# Altium project QMKMouse.PrjPCB
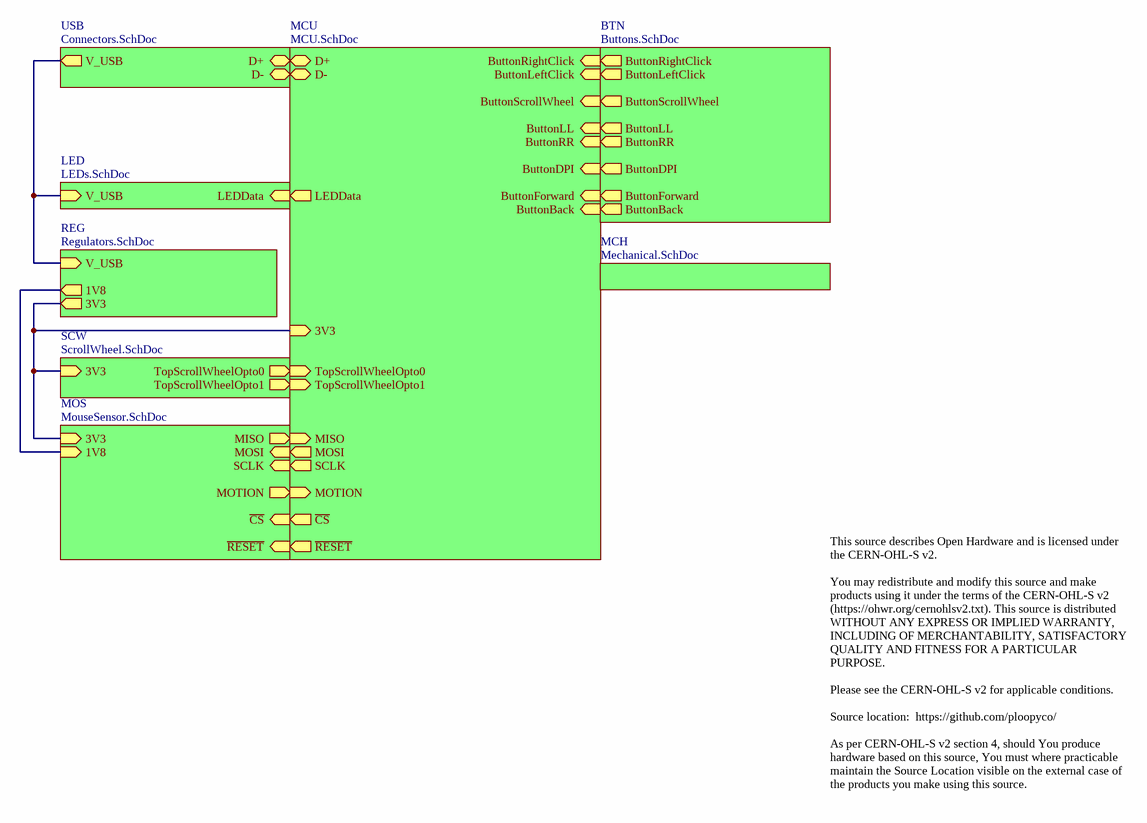
[diagram p0: QMKMouse.SchDoc]
9 sheets, 110 parts. Net scope: hierarchical (ports join the sheet entries above them; power ports are global).
Board files: QMKMouse.PcbDoc, QMKMouseSolderStencil.PcbDoc, QMKMousePanel.PcbDoc
Sheets:
  QMKMouse.SchDoc
    USB = Connectors.SchDoc
    LED = LEDs.SchDoc
    REG = Regulators.SchDoc
    SCW = ScrollWheel.SchDoc
    MOS = MouseSensor.SchDoc
    MCU = MCU.SchDoc
    BTN = Buttons.SchDoc
    MCH = Mechanical.SchDoc

## Sheet QMKMouse.SchDoc
size Letter; CompanyName: Ploopy Corporation; Organization: Ploopy Corporation; Address1: 137-1140 Burnhamthorpe Road W; Address2: Mississauga; Address3: Ontario; Address4: Canada L5C 0A3; DocumentNumber: 1; Revision: R1.003; SheetNumber: 1; SheetTotal: 9

### Sub-sheets
BTN = Buttons.SchDoc: ButtonRightClick (out), ButtonLeftClick (out), ButtonScrollWheel (out), ButtonLL (out), ButtonRR (out), ButtonDPI (out), ButtonForward (out), ButtonBack (out)
LED = LEDs.SchDoc: V_USB (in), LEDData (in)
MCH = Mechanical.SchDoc: no entries
MCU = MCU.SchDoc: D+ (bidir), D- (bidir), ButtonRightClick (in), ButtonLeftClick (in), ButtonScrollWheel (in), ButtonLL (in), ButtonRR (in), ButtonDPI (in), ButtonForward (in), ButtonBack (in), LEDData (out), 3V3 (in), TopScrollWheelOpto1 (in), TopScrollWheelOpto0 (in), MOSI (out), SCLK (out), MISO (in), ~{CS} (out), ~{RESET} (out), MOTION (in)
MOS = MouseSensor.SchDoc: 1V8 (in), 3V3 (in), ~{CS} (in), MISO (out), MOSI (in), SCLK (in), ~{RESET} (in), MOTION (out)
REG = Regulators.SchDoc: 3V3 (out), V_USB (in), 1V8 (out)
SCW = ScrollWheel.SchDoc: TopScrollWheelOpto1 (out), TopScrollWheelOpto0 (out), 3V3 (in)
USB = Connectors.SchDoc: D+ (bidir), V_USB (out), D- (bidir)

### Nets
1V8: sheet REG/1V8, sheet MOS/1V8
3V3: sheet REG/3V3, sheet SCW/3V3, sheet MOS/3V3, sheet MCU/3V3
LEDData: sheet LED/LEDData, sheet MCU/LEDData
V_USB: sheet USB/V_USB, sheet LED/V_USB, sheet REG/V_USB
NetQt1_E: sheet SCW/TopScrollWheelOpto0, sheet MCU/TopScrollWheelOpto0
NetQt2_E: sheet SCW/TopScrollWheelOpto1, sheet MCU/TopScrollWheelOpto1
NetR5_1: sheet MOS/MISO, sheet MCU/MISO
NetR6_2: sheet USB/D-, sheet MCU/D-
NetR7_2: sheet USB/D+, sheet MCU/D+
NetSW1_A: sheet MCU/ButtonLeftClick, sheet BTN/ButtonLeftClick
NetSW2_A: sheet MCU/ButtonRightClick, sheet BTN/ButtonRightClick
NetSW3_A: sheet MCU/ButtonRR, sheet BTN/ButtonRR
NetSW4_A: sheet MCU/ButtonLL, sheet BTN/ButtonLL
NetSW5_A: sheet MCU/ButtonForward, sheet BTN/ButtonForward
NetSW6_A: sheet MCU/ButtonDPI, sheet BTN/ButtonDPI
NetSW7_A: sheet MCU/ButtonBack, sheet BTN/ButtonBack
NetSW8_A: sheet MCU/ButtonScrollWheel, sheet BTN/ButtonScrollWheel
NetU2_7: sheet MOS/~{RESET}, sheet MCU/~{RESET}
NetU2_9: sheet MOS/MOTION, sheet MCU/MOTION
NetU2_10: sheet MOS/SCLK, sheet MCU/SCLK
NetU2_11: sheet MOS/MOSI, sheet MCU/MOSI
NetU2_13: sheet MOS/~{CS}, sheet MCU/~{CS}

### Notes on the sheet
- This source describes Open Hardware and is licensed under the CERN-OHL-S v2.
  You may redistribute and modify this source and make products using it under the terms of the CERN-OHL-S v2 (https://ohwr.org/cernohlsv2.txt). This source is distributed WITHOUT ANY EXPRESS OR IMPLIED WARRANTY, INCLUDING OF MERCHANTABILITY, SATISFACTORY QUALITY AND FITNESS FOR A PARTICULAR PURPOSE.
  Please see the CERN-OHL-S v2 for applicable conditions.
  Source location:  https://github.com/ploopyco/
  As per CERN-OHL-S v2 section 4, should You produce hardware based on this source, You must where practicable maintain the Source Location visible on the external case of the products you make using this source.
- Copyright Ploopy Corporation 2024
- Licensed under the CERN-OHL-S v2
- http://ohwr.org/cernohl
- Title:
- PCB:
- Version:
- Ploopy Corporation
- Mississauga ON L5C 0A3
- 137-1140 Burnhamthorpe Road W
- Date:
- Time:
- Sheet
- of
- Canada

## Sheet Connectors.SchDoc
size Letter; CompanyName: Ploopy Corporation; Organization: Ploopy Corporation; Address1: 137-1140 Burnhamthorpe Road W; Address2: Mississauga; Address3: Ontario; Address4: Canada L5C 0A3; DocumentNumber: 3; Revision: R1.003; SheetNumber: 3; SheetTotal: 9
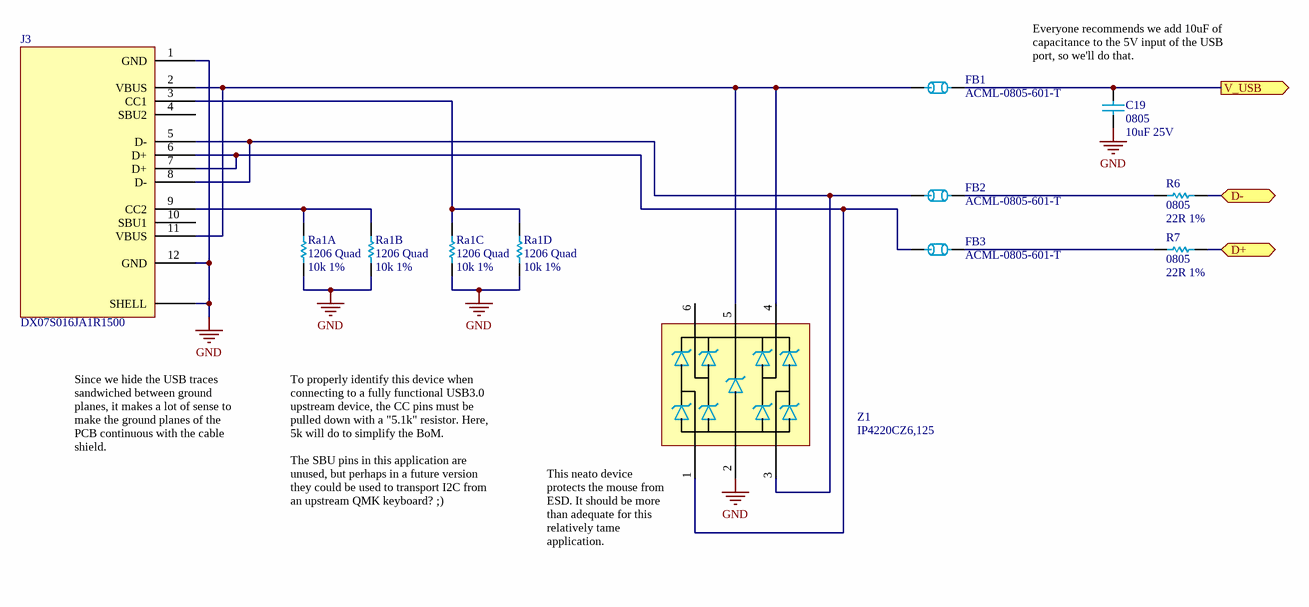
[diagram p1: Connectors.SchDoc]

### Parts
C19  0805  value 10uF 25V  [0805]
FB1  ACML-0805-601-T  [0805]
FB2  ACML-0805-601-T  [0805]
FB3  ACML-0805-601-T  [0805]
J3  DX07S016JA1R1500  [DX07S016JA1R1500]
R6  0805  value 22R 1%  [0805]
R7  0805  value 22R 1%  [0805]
Ra1  1206 Quad  value 10k 1%  [4x 10k 1% - CAC-80P320X160-8M]  (parts A,B,C,D of 4)
Z1  IP4220CZ6,125  [PESD3V3S4UD - SOT95P275X110-6N]

### Ports
D+ (bidir), D- (bidir), V_USB (out)

### Nets
GND: C19.1 J3.1(GND) J3.12(GND) J3.SHELL Ra1.1 Ra1.2 Ra1.3 Ra1.4 Z1.2
V_USB: C19.2 FB1.2 ; port V_USB
NetFB1_1: FB1.1 J3.2(VBUS) J3.11(VBUS) Z1.4 Z1.5
NetFB2_1: FB2.1 J3.5(D-) J3.8(D-) Z1.3
NetFB2_2: FB2.2 R6.1
NetFB3_1: FB3.1 J3.6(D+) J3.7(D+) Z1.1
NetFB3_2: FB3.2 R7.1
NetJ3_3: J3.3(CC1) Ra1.5 Ra1.6
NetJ3_9: J3.9(CC2) Ra1.7 Ra1.8
NetR6_2: R6.2 ; port D-
NetR7_2: R7.2 ; port D+

Not connected (* = marked no-connect by the designer): J3 4(SBU2) 10(SBU1); Z1 6

### Notes on the sheet
- (near C19) Everyone recommends we add 10uF of capacitance to the 5V input of the USB port, so we'll do that.
- Since we hide the USB traces sandwiched between ground planes, it makes a lot of sense to make the ground planes of the PCB continuous with the cable shield.
- To properly identify this device when connecting to a fully functional USB3.0 upstream device, the CC pins must be pulled down with a "5.1k" resistor. Here, 5k will do to simplify the BoM.
  The SBU pins in this application are unused, but perhaps in a future version they could be used to transport I2C from an upstream QMK keyboard? ;)
- (near Z1) This neato device protects the mouse from ESD. It should be more than adequate for this relatively tame application.
- Copyright Ploopy Corporation 2024
- Licensed under the CERN-OHL-S v2
- http://ohwr.org/cernohl
- Title:
- PCB:
- Version:
- Ploopy Corporation
- Mississauga ON L5C 0A3
- 137-1140 Burnhamthorpe Road W
- Date:
- Time:
- Sheet
- of
- Canada

### Library data of the parts
C19 = Cap 10uF 25V: 0805, X5R or better; PNP-Nzl: 2; PNP-dx: 0; PNP-X: 2.00; PNP-Y: 1.25; PNP-Lv: 1; PNP-TS: 70; PNP-Type: chi; PNP-FeedType: Tape; PNP-TapeWidth: 8; PNP-dy: 0; PNP-Pt: 0; PNP-W: 0; PNP-Thk: 1.25; PNP-Level: 1; PNP-Voff: 0; PNP-PlacePriority: 1; PNP-A: 0; PNP-TapeIndex: 1; Supplier 1: Mouser; Supplier Part Number 1: 81-GRM21BR61E106KA3L; Supplier 2: Digi-Key; Supplier Part Number 2: 490-5523-1-ND; PNP-da: 0
FB1-FB3 = ACML-0805-601-T: FERRITE BEAD 600 OHM 0805 1LN; PNP-Nzl: 2; PNP-dx: 0; PNP-X: 2.00; PNP-Y: 1.25; PNP-Thk: 0.55; PNP-Lv: 1; PNP-TS: 70; PNP-Type: chi; PNP-FeedType: Tape; PNP-TapeWidth: 8; PNP-dy: 0; PNP-Pt: 0; PNP-W: 0; PNP-Level: 1; PNP-Voff: 0; PNP-PlacePriority: 1; PNP-A: 0; PNP-TapeIndex: 1; PNP-da: 0; Supplier 1: Digi-Key; Supplier Part Number 1: 535-12556-1-ND
J3 = DX07S016JA1R1500: USB-C (USB TYPE-C) USB 2.0 Receptacle Connector 24 (16+8 Dummy) Position Surface Mount, Right Angle; Through Hole; Supplier 1: Digi-Key; Supplier 2: Mouser; Supplier Part Number 1: 670-DX07S016JA1R1500CT-ND; Supplier Part Number 2: 656-DX07S016JA1R1500
R6 R7 = Res 22R 1% 0805: Chip resistor; PNP-Nzl: 2; PNP-dx: 0; PNP-X: 2.00; PNP-Y: 1.25; PNP-Thk: 0.55; PNP-Lv: 1; PNP-TS: 70; PNP-Type: chi; PNP-FeedType: Tape; PNP-TapeWidth: 8; PNP-dy: 0; PNP-Pt: 0; PNP-W: 0; PNP-Level: 1; PNP-Voff: 0; PNP-PlacePriority: 1; PNP-A: 0; PNP-TapeIndex: 1; PNP-da: 0; Supplier 1: Digi-Key; Supplier 2: Arrow; Supplier Part Number 1: RMCF0805FT22R0CT-ND; Supplier Part Number 2: RMCF0805FT22R0
Ra1 = Quad Res 10k 1% 1206: Chip resistor
Z1 = IP4220CZ6,125: TVS DIODE 5.5V 6TSOP (Low capacitance, USB); PNP-Nzl: 2; PNP-dx: 0; PNP-X: 2.9; PNP-Y: 1.3; PNP-A: 270; PNP-Thk: 1; PNP-Lv: 26; PNP-TS: 90; PNP-Type: CHP; PNP-FeedType: Tape; PNP-TapeWidth: 8; PNP-PlacePriority: 3; PNP-dy: 0; PNP-Pt: 0; PNP-W: 0; PNP-Level: 1; PNP-Voff: 0; PNP-TapeIndex: 1; PNP-da: 0

## Sheet LEDs.SchDoc
size Letter; CompanyName: Ploopy Corporation; Organization: Ploopy Corporation; Address1: 137-1140 Burnhamthorpe Road W; Address2: Mississauga; Address3: Ontario; Address4: Canada L5C 0A3; DocumentNumber: 4; Revision: R1.003; SheetNumber: 4; SheetTotal: 9
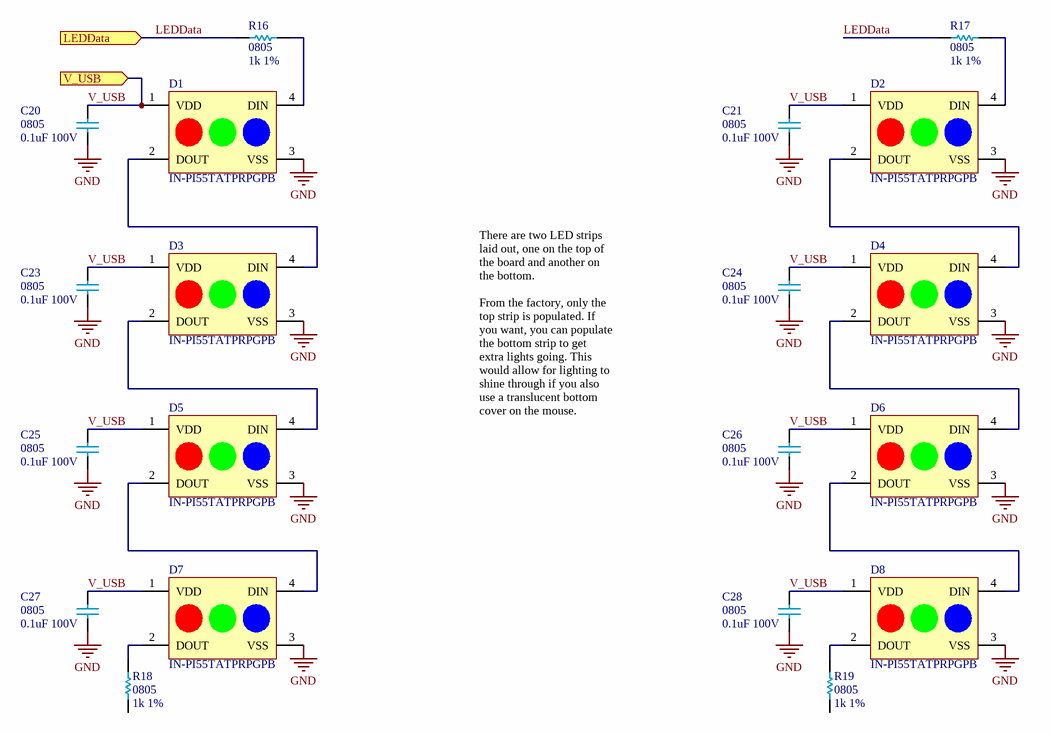
[diagram p2: LEDs.SchDoc]

### Parts
C20  0805  value 0.1uF 100V  [0805]
C21  0805  value 0.1uF 100V  [0805]
C23  0805  value 0.1uF 100V  [0805]
C24  0805  value 0.1uF 100V  [0805]
C25  0805  value 0.1uF 100V  [0805]
C26  0805  value 0.1uF 100V  [0805]
C27  0805  value 0.1uF 100V  [0805]
C28  0805  value 0.1uF 100V  [0805]
D1  IN-PI55TATPRPGPB  [IN-PI55TATPRPGPB]
D2  IN-PI55TATPRPGPB  [IN-PI55TATPRPGPB]
D3  IN-PI55TATPRPGPB  [IN-PI55TATPRPGPB]
D4  IN-PI55TATPRPGPB  [IN-PI55TATPRPGPB]
D5  IN-PI55TATPRPGPB  [IN-PI55TATPRPGPB]
D6  IN-PI55TATPRPGPB  [IN-PI55TATPRPGPB]
D7  IN-PI55TATPRPGPB  [IN-PI55TATPRPGPB]
D8  IN-PI55TATPRPGPB  [IN-PI55TATPRPGPB]
R16  0805  value 1k 1%  [0805]
R17  0805  value 1k 1%  [0805]
R18  0805  value 1k 1%  [0805]
R19  0805  value 1k 1%  [0805]

### Ports
LEDData (in), V_USB (in)

### Nets
GND: C20.1 C21.1 C23.1 C24.1 C25.1 C26.1 C27.1 C28.1 D1.3(VSS) D2.3(VSS) D3.3(VSS) D4.3(VSS) D5.3(VSS) D6.3(VSS) D7.3(VSS) D8.3(VSS)
LEDData: R16.2 R17.2 ; port LEDData
V_USB: C20.2 C21.2 C23.2 C24.2 C25.2 C26.2 C27.2 C28.2 D1.1(VDD) D2.1(VDD) D3.1(VDD) D4.1(VDD) D5.1(VDD) D6.1(VDD) D7.1(VDD) D8.1(VDD) ; port V_USB
NetD1_2: D1.2(DOUT) D3.4(DIN)
NetD1_4: D1.4(DIN) R16.1
NetD2_2: D2.2(DOUT) D4.4(DIN)
NetD2_4: D2.4(DIN) R17.1
NetD3_2: D3.2(DOUT) D5.4(DIN)
NetD4_2: D4.2(DOUT) D6.4(DIN)
NetD5_2: D5.2(DOUT) D7.4(DIN)
NetD6_2: D6.2(DOUT) D8.4(DIN)
NetD7_2: D7.2(DOUT) R18.2
NetD8_2: D8.2(DOUT) R19.2

Not connected (* = marked no-connect by the designer): R18 1; R19 1

### Notes on the sheet
- There are two LED strips laid out, one on the top of the board and another on the bottom.
  From the factory, only the top strip is populated. If you want, you can populate the bottom strip to get extra lights going. This would allow for lighting to shine through if you also use a translucent bottom cover on the mouse.
- Copyright Ploopy Corporation 2024
- Licensed under the CERN-OHL-S v2
- http://ohwr.org/cernohl
- Title:
- PCB:
- Version:
- Ploopy Corporation
- Mississauga ON L5C 0A3
- 137-1140 Burnhamthorpe Road W
- Date:
- Time:
- Sheet
- of
- Canada

### Library data of the parts
C20 C21 C23-C28 = Cap 0.1uF 100V: 0805, X5R or better; Supplier 1: Digi-Key; Supplier Part Number 1: 1276-6840-2-ND
D1-D8 = IN-PI55TATPRPGPB: ADDRESS LED DISCRETE SERIAL RGB; Supplier 1: Digi-Key; Supplier 2: Arrow; Supplier 3: Mouser; Supplier Part Number 1: 1830-1204-1-ND; Supplier Part Number 2: IN-PI55TATPRPGPB; Supplier Part Number 3: 743-IN-PI55TATPRPGPB
R16-R19 = Res 1k 1% 0805: Chip resistor, 1/8W 100PPM; Supplier 1: Digi-Key; Supplier Part Number 1: RMCF0805FT1K00TR-ND

## Sheet Regulators.SchDoc
size Letter; CompanyName: Ploopy Corporation; Organization: Ploopy Corporation; Address1: 137-1140 Burnhamthorpe Road W; Address2: Mississauga; Address3: Ontario; Address4: Canada L5C 0A3; DocumentNumber: 8; Revision: R1.003; SheetNumber: 8; SheetTotal: 9
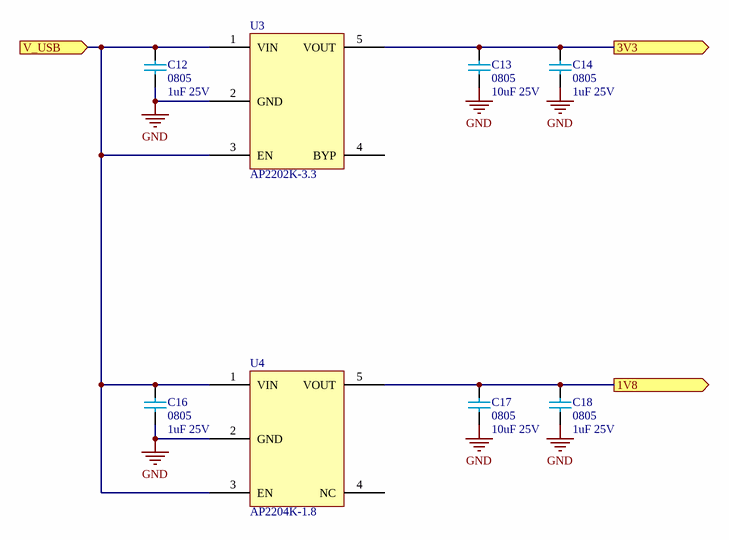
[diagram p3: Regulators.SchDoc]

### Parts
C12  0805  value 1uF 25V  [0805]
C13  0805  value 10uF 25V  [0805]
C14  0805  value 1uF 25V  [0805]
C16  0805  value 1uF 25V  [0805]
C17  0805  value 10uF 25V  [0805]
C18  0805  value 1uF 25V  [0805]
U3  AP2202K-3.3  [AP2202 - SOT95P270X145-5N]
U4  AP2204K-1.8  [AP2202 - SOT95P270X145-5N]

### Ports
1V8 (out), 3V3 (out), V_USB (in)

### Nets
GND: C12.1 C13.1 C14.1 C16.1 C17.1 C18.1 U3.2(GND) U4.2(GND)
1V8: C17.2 C18.2 U4.5(VOUT) ; port 1V8
3V3: C13.2 C14.2 U3.5(VOUT) ; port 3V3
V_USB: C12.2 C16.2 U3.1(VIN) U3.3(EN) U4.1(VIN) U4.3(EN) ; port V_USB

Not connected (* = marked no-connect by the designer): U3 4(BYP); U4 4(NC)

### Notes on the sheet
- Copyright Ploopy Corporation 2024
- Licensed under the CERN-OHL-S v2
- http://ohwr.org/cernohl
- Title:
- PCB:
- Version:
- Ploopy Corporation
- Mississauga ON L5C 0A3
- 137-1140 Burnhamthorpe Road W
- Date:
- Time:
- Sheet
- of
- Canada

### Library data of the parts
C12 C14 C16 C18 = Cap 1uF 25V: 0805, X5R or better; PNP-Nzl: 2; PNP-dx: 0; PNP-Level: 1; PNP-Thk: 1.25; PNP-TS: 70; PNP-Type: chi; PNP-X: 2.00; PNP-FeedType: Tape; PNP-TapeWidth: 8; Supplier 1: Digi-Key; Supplier Part Number 1: 1276-1066-2-ND; Supplier 2: Digi-Key; Supplier Part Number 2: 1276-1066-1-ND; PNP-dy: 0; PNP-Lv: 1; PNP-Pt: 0; PNP-Voff: 0; PNP-W: 0; PNP-Y: 1.25; PNP-A: 0; PNP-PlacePriority: 1; PNP-TapeIndex: 1; PNP-da: 0
C13 C17 = Cap 10uF 25V: as C19 on sheet Connectors; PNP-dy: 0; PNP-Pt: 0; PNP-W: 0; PNP-Thk: 1.25; PNP-Level: 1; PNP-Voff: 0; PNP-PlacePriority: 1; PNP-A: 0; PNP-TapeIndex: 1; Supplier 1: Mouser; Supplier Part Number 1: 81-GRM21BR61E106KA3L; Supplier 2: Digi-Key; Supplier Part Number 2: 490-5523-1-ND; PNP-da: 0
U3 = AP2202K-3.3: 3.3V 150mA LDO regulator; PNP-Nzl: 2; PNP-dx: 0; PNP-X: 2.9; PNP-Y: 1.3; PNP-A: 90; PNP-Thk: 1; PNP-Lv: 26; PNP-Type: CHP; PNP-FeedType: Tape; PNP-TapeWidth: 8; PNP-PlacePriority: 3; PNP-dy: 0; PNP-Pt: 0; PNP-W: 0; PNP-TS: 90; PNP-Level: 1; PNP-Voff: 0; PNP-TapeIndex: 1; Supplier 1: Mouser; Supplier Part Number 1: 621-AP2202K-3.3TRG1; Supplier 2: Digi-Key; Supplier Part Number 2: AP2202K-3.3TRG1DICT-ND; Supplier 3: Arrow; Supplier Part Number 3: PWagzdsTFFHKE_U17B45SP-NtndBrheJIaI5hB7gHD0ZVywxIBNyoAQstvnyfZZ0; PNP-da: 0
U4 = AP2204K-1.8: Linear Voltage Regulator IC 1 Output 150mA SOT-23-5; PNP-Nzl: 2; PNP-dx: 0; PNP-X: 2.9; PNP-Y: 1.3; PNP-A: 90; PNP-Thk: 1; PNP-Lv: 26; PNP-Type: CHP; PNP-FeedType: Tape; PNP-TapeWidth: 8; PNP-PlacePriority: 3; PNP-dy: 0; PNP-Pt: 0; PNP-W: 0; PNP-TS: 90; PNP-Level: 1; PNP-Voff: 0; PNP-TapeIndex: 1; PNP-da: 0; Supplier 1: Digi-Key; Supplier 2: Mouser; Supplier Part Number 1: AP2204K-1.8TRG1DICT-ND; Supplier Part Number 2: 621-AP2204K-1.8TRG1

## Sheet ScrollWheel.SchDoc
size Letter; CompanyName: Ploopy Corporation; Organization: Ploopy Corporation; Address1: 137-1140 Burnhamthorpe Road W; Address2: Mississauga; Address3: Ontario; Address4: Canada L5C 0A3; DocumentNumber: 9; Revision: R1.003; SheetNumber: 9; SheetTotal: 9
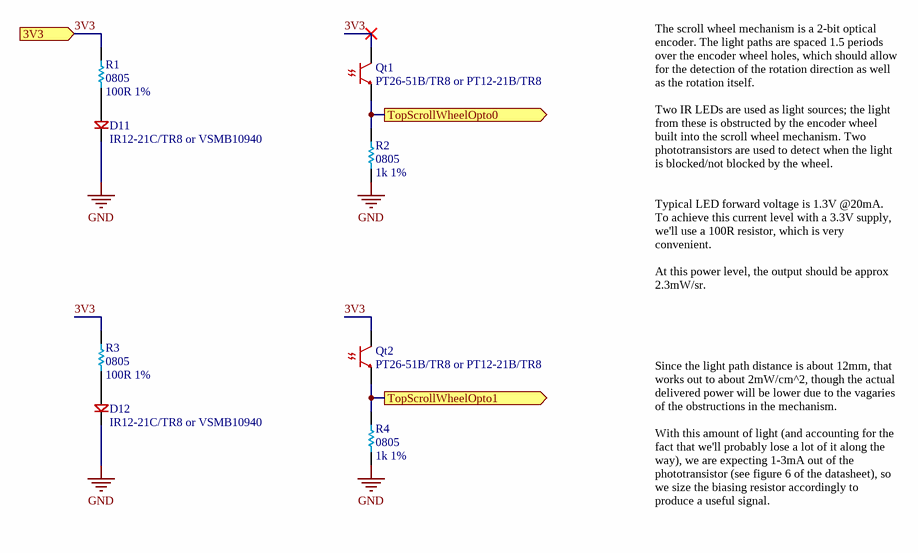
[diagram p4: ScrollWheel.SchDoc]

### Parts
(Parts that share a designator on the sheet are numbered #1, #2 ... from top to bottom, then left to right.)
D11  IR12-21C/TR8 or VSMB10940  [IR12-21C/TR8]
D12  IR12-21C/TR8 or VSMB10940  [IR12-21C/TR8]
Qt1  PT26-51B/TR8 or PT12-21B/TR8  [PT26-51B/TR8]
Qt2  PT26-51B/TR8 or PT12-21B/TR8  [PT26-51B/TR8]
R1  0805  value 100R 1%  [0805]
R2  0805  value 1k 1%  [0805]
R3#1  0805  value 100R 1%  [0805]
R4#1  0805  value 1k 1%  [0805]

### Ports
3V3 (in), TopScrollWheelOpto0 (out), TopScrollWheelOpto1 (out)

### Nets
GND: D11.C D12.C R2.1 R4#1.1
3V3: Qt1.C Qt2.C R1.2 R3#1.2 ; port 3V3
NetD11_A: D11.A R1.1
NetD12_A: D12.A R3#1.1
NetQt1_E: Qt1.E R2.2 ; port TopScrollWheelOpto0
NetQt2_E: Qt2.E R4#1.2 ; port TopScrollWheelOpto1

### Notes on the sheet
- The scroll wheel mechanism is a 2-bit optical encoder. The light paths are spaced 1.5 periods over the encoder wheel holes, which should allow for the detection of the rotation direction as well as the rotation itself.
  Two IR LEDs are used as light sources; the light from these is obstructed by the encoder wheel built into the scroll wheel mechanism. Two phototransistors are used to detect when the light is blocked/not blocked by the wheel.
  Typical LED forward voltage is 1.3V @20mA. To achieve this current level with a 3.3V supply, we'll use a 100R resistor, which is very convenient.
  At this power level, the output should be approx 2.3mW/sr.
  Since the light path distance is about 12mm, that works out to about 2mW/cm^2, though the actual delivered power will be lower due to the vagaries of the obstructions in the mechanism.
  With this amount of light (and accounting for the fact that we'll probably lose a lot of it along the way), we are expecting 1-3mA out of the phototransistor (see figure 6 of the datasheet), so we size the biasing resistor accordingly to produce a useful signal.
- Copyright Ploopy Corporation 2024
- Licensed under the CERN-OHL-S v2
- http://ohwr.org/cernohl
- Title:
- PCB:
- Version:
- Ploopy Corporation
- Mississauga ON L5C 0A3
- 137-1140 Burnhamthorpe Road W
- Date:
- Time:
- Sheet
- of
- Canada

### Library data of the parts
D11 D12 = IR12-21C/TR8: Infrared (IR) Emitter 880nm 1.3V 50mA 1mW/sr @ 20mA 30° 2-SMD, No Lead; Supplier 1: Digi-Key; Supplier 2: Mouser; Supplier 3: Digi-Key; Supplier 4: Mouser; Supplier 5: Arrow; Supplier Part Number 1: 1080-1351-1-ND; Supplier Part Number 2: 638-IR12-21C; Supplier Part Number 3: VSMB10940CT-ND; Supplier Part Number 4: 78-VSMB10940; Supplier Part Number 5: VSMB10940
Qt1 Qt2 = PT26-51B/TR8: Phototransistor 940nm Side View 1206 (3216 Metric); Supplier 1: Digi-Key; Supplier Part Number 1: 1080-1387-1-ND; Supplier 2: Digi-Key; Supplier Part Number 2: 1080-1377-1-ND
R1 R3#1 = Res 100R 1% 0805: Chip resistor; PNP-Nzl: 2; PNP-dx: 0; PNP-X: 2.00; PNP-Y: 1.25; PNP-Thk: 0.55; PNP-Lv: 1; PNP-TS: 70; PNP-Type: chi; PNP-FeedType: Tape; PNP-TapeWidth: 8; Supplier 1: Digi-Key; Supplier 2: Digi-Key; Supplier Part Number 1: RMCF0805FT100RCT-ND; Supplier Part Number 2: RMCF0805FT100RTR-ND; PNP-dy: 0; PNP-Pt: 0; PNP-W: 0; PNP-Level: 1; PNP-Voff: 0; PNP-PlacePriority: 1; PNP-A: 0; PNP-TapeIndex: 1; PNP-da: 0
R2 R4#1 = Res 1k 1% 0805: Chip resistor, 1/8W 100PPM; PNP-Nzl: 2; PNP-dx: 0; PNP-X: 2.00; PNP-Y: 1.25; PNP-Thk: 0.55; PNP-Lv: 1; PNP-TS: 70; PNP-Type: chi; PNP-FeedType: Tape; PNP-TapeWidth: 8; Supplier 1: Digi-Key; Supplier Part Number 1: RMCF0805FT1K00TR-ND; PNP-dy: 0; PNP-Pt: 0; PNP-W: 0; PNP-Level: 1; PNP-Voff: 0; PNP-PlacePriority: 1; PNP-A: 0; PNP-TapeIndex: 1; PNP-da: 0

## Sheet MouseSensor.SchDoc
size Letter; CompanyName: Ploopy Corporation; Organization: Ploopy Corporation; Address1: 137-1140 Burnhamthorpe Road W; Address2: Mississauga; Address3: Ontario; Address4: Canada L5C 0A3; DocumentNumber: 7; Revision: R1.003; SheetNumber: 7; SheetTotal: 9
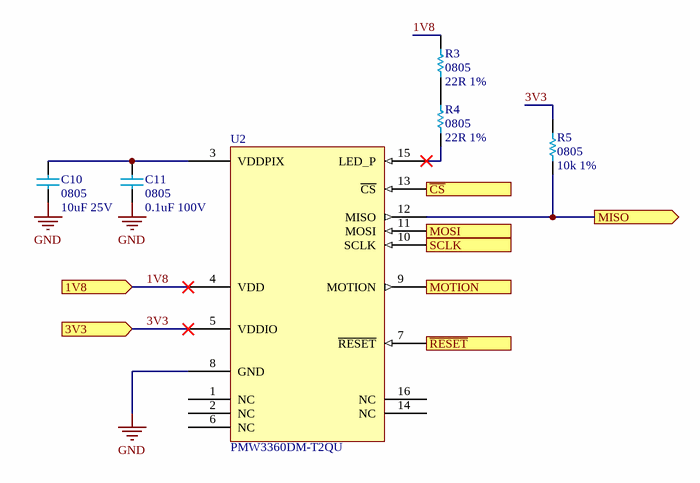
[diagram p5: MouseSensor.SchDoc]

### Parts
(Parts that share a designator on the sheet are numbered #1, #2 ... from top to bottom, then left to right.)
C10  0805  value 10uF 25V  [0805]
C11  0805  value 0.1uF 100V  [0805]
R3#2  0805  value 22R 1%  [0805]
R4#2  0805  value 22R 1%  [0805]
R5  0805  value 10k 1%  [0805]
U2  PMW3360DM-T2QU  [PMW3360DM-T2QU]

### Ports
1V8 (in), 3V3 (in), MISO (out), MOSI (in), MOTION (out), SCLK (in), ~{CS} (in), ~{RESET} (in)

### Nets
GND: C10.1 C11.1 U2.8(GND)
1V8: R3#2.2 U2.4(VDD) ; port 1V8
3V3: R5.2 U2.5(VDDIO) ; port 3V3
NetC10_2: C10.2 C11.2 U2.3(VDDPIX)
NetR3#2_1: R3#2.1 R4#2.2
NetR4#2_1: R4#2.1 U2.15(LED_P)
NetR5_1: R5.1 U2.12(MISO) ; port MISO
NetU2_7: U2.7(~{RESET}) ; port ~{RESET}
NetU2_9: U2.9(MOTION) ; port MOTION
NetU2_10: U2.10(SCLK) ; port SCLK
NetU2_11: U2.11(MOSI) ; port MOSI
NetU2_13: U2.13(~{CS}) ; port ~{CS}

Not connected (* = marked no-connect by the designer): U2 1(NC) 2(NC) 6(NC) 14(NC) 16(NC)

### Notes on the sheet
- Copyright Ploopy Corporation 2024
- Licensed under the CERN-OHL-S v2
- http://ohwr.org/cernohl
- Title:
- PCB:
- Version:
- Ploopy Corporation
- Mississauga ON L5C 0A3
- 137-1140 Burnhamthorpe Road W
- Date:
- Time:
- Sheet
- of
- Canada

### Library data of the parts
C10 = Cap 10uF 25V: as C19 on sheet Connectors; PNP-dy: 0; PNP-Pt: 0; PNP-W: 0; PNP-Thk: 1.25; PNP-Level: 1; PNP-Voff: 0; PNP-PlacePriority: 1; PNP-A: 0; PNP-TapeIndex: 1; Supplier 1: Mouser; Supplier Part Number 1: 81-GRM21BR61E106KA3L; Supplier 2: Digi-Key; Supplier Part Number 2: 490-5523-1-ND; PNP-da: 0
C11 = Cap 0.1uF 100V: 0805, X5R or better; PNP-Nzl: 2; PNP-dx: 0; PNP-Level: 1; PNP-Thk: 1.05; PNP-TS: 70; PNP-Type: chi; PNP-X: 2.00; PNP-Y: 1.25; PNP-FeedType: Tape; PNP-TapeWidth: 8; Supplier 1: Digi-Key; Supplier Part Number 1: 1276-6840-2-ND; PNP-dy: 0; PNP-Lv: 1; PNP-Pt: 0; PNP-Voff: 0; PNP-W: 0; PNP-A: 0; PNP-PlacePriority: 1; PNP-TapeIndex: 1; PNP-da: 0
R3#2 R4#2 = Res 22R 1% 0805: as R6 on sheet Connectors; PNP-dy: 0; PNP-Pt: 0; PNP-W: 0; PNP-Level: 1; PNP-Voff: 0; PNP-PlacePriority: 1; PNP-A: 0; PNP-TapeIndex: 1; PNP-da: 0; Supplier 1: Digi-Key; Supplier 2: Arrow; Supplier Part Number 1: RMCF0805FT22R0CT-ND; Supplier Part Number 2: RMCF0805FT22R0
R5 = Res 10k 1% 0805: Chip resistor; PNP-Nzl: 2; PNP-dx: 0; PNP-X: 2.00; PNP-Y: 1.25; PNP-Thk: 0.55; PNP-Lv: 1; PNP-TS: 70; PNP-Type: chi; PNP-FeedType: Tape; PNP-TapeWidth: 8; Supplier 1: Digi-Key; Supplier Part Number 1: RMCF0805FT10K0TR-ND; PNP-dy: 0; PNP-Pt: 0; PNP-W: 0; PNP-Level: 1; PNP-Voff: 0; PNP-PlacePriority: 1; PNP-A: 0; PNP-TapeIndex: 1; PNP-da: 0
U2 = PMW3360DM-T2QU: Optical Gaming Navigation Sensor; PNP-Nzl: 4; PNP-dx: 0; PNP-X: 4.9; PNP-Y: 3.9; PNP-W: 0.1; PNP-Thk: 1.45; PNP-Lv: 26; PNP-TS: 70; PNP-Level: 1.3; PNP-Type: QFP; PNP-FeedType: Tape; PNP-TapeWidth: 12; PNP-PlacePriority: 3; PNP-TapeIndex: 2; PNP-dy: 0; PNP-A: 0; PNP-Pt: 0; PNP-Voff: 0; PNP-da: 0

## Sheet MCU.SchDoc
size Tabloid; CompanyName: Ploopy Corporation; Organization: Ploopy Corporation; Address1: 137-1140 Burnhamthorpe Road W; Address2: Mississauga; Address3: Ontario; Address4: Canada L5C 0A3; DocumentNumber: 5; Revision: R1.003; SheetNumber: 5; SheetTotal: 9
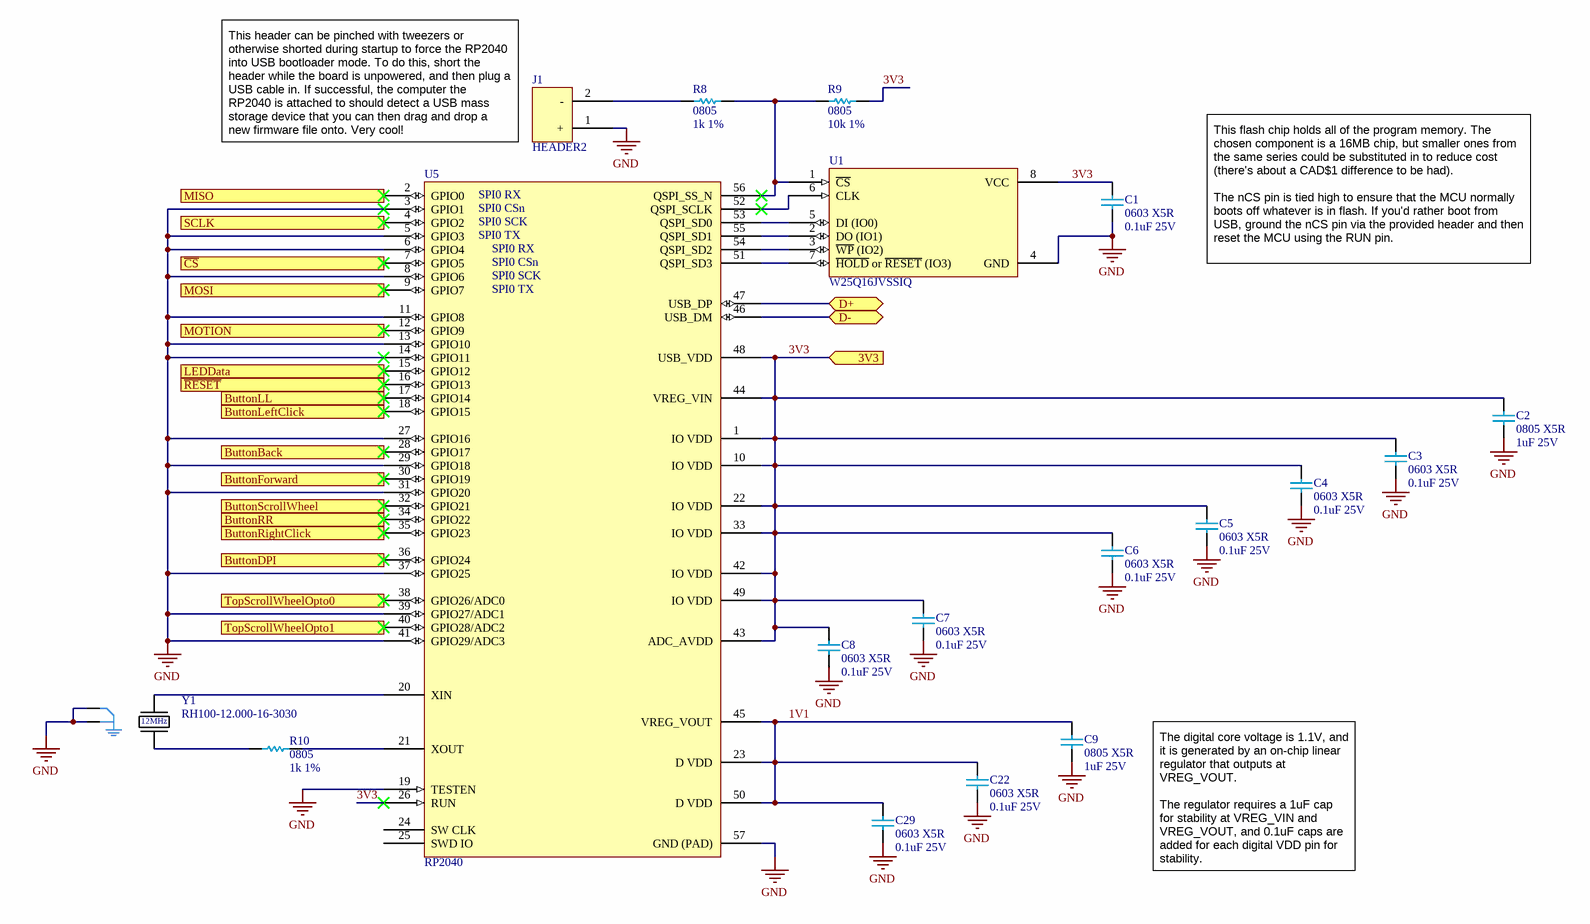
[diagram p6: MCU.SchDoc]

### Parts
C1  0603 X5R  value 0.1uF 25V  [0603 capacitor - CAPC1608X06N]
C2  0805 X5R  value 1uF 25V  [0805 - TALL]
C3  0603 X5R  value 0.1uF 25V  [0603 capacitor - CAPC1608X06N]
C4  0603 X5R  value 0.1uF 25V  [0603 capacitor - CAPC1608X06N]
C5  0603 X5R  value 0.1uF 25V  [0603 capacitor - CAPC1608X06N]
C6  0603 X5R  value 0.1uF 25V  [0603 capacitor - CAPC1608X06N]
C7  0603 X5R  value 0.1uF 25V  [0603 capacitor - CAPC1608X06N]
C8  0603 X5R  value 0.1uF 25V  [0603 capacitor - CAPC1608X06N]
C9  0805 X5R  value 1uF 25V  [0805 - TALL]
C22  0603 X5R  value 0.1uF 25V  [0603 capacitor - CAPC1608X06N]
C29  0603 X5R  value 0.1uF 25V  [0603 capacitor - CAPC1608X06N]
J1  HEADER2  [2x1]
R8  0805  value 1k 1%  [0805]
R9  0805  value 10k 1%  [0805]
R10  0805  value 1k 1%  [0805]
U1  W25Q16JVSSIQ  [W25Q128JVS - SOIC127P790X216-8M]
U5  RP2040  [RP2040 - QFN40P700X700X90_HS-57M]
Y1  RH100-12.000-16-3030  [RH100-12.000-16-3030]

### Ports
3V3 (in), ButtonBack (in), ButtonDPI (in), ButtonForward (in), ButtonLeftClick (in), ButtonLL (in), ButtonRightClick (in), ButtonRR (in), ButtonScrollWheel (in), D+ (bidir), D- (bidir), LEDData (out), MISO (in), MOSI (out), MOTION (in), SCLK (out), TopScrollWheelOpto0 (in), TopScrollWheelOpto1 (in), ~{CS} (out), ~{RESET} (out)

### Nets
GND: C1.1 C2.1 C3.1 C4.1 C5.1 C6.1 C7.1 C8.1 C9.1 C22.1 C29.1 J1.1(+) U1.4(GND) U5.3(GPIO1) U5.5(GPIO3) U5.6(GPIO4) U5.8(GPIO6) U5.11(GPIO8) U5.13(GPIO10) U5.14(GPIO11) U5.19(TESTEN) U5.27(GPIO16) U5.29(GPIO18) U5.31(GPIO20) U5.37(GPIO25) U5.39(GPIO27/ADC1) U5.41(GPIO29/ADC3) U5.57(GND_(PAD)) Y1.2 Y1.4
1V1: C9.2 C22.2 C29.2 U5.23(D_VDD) U5.45(VREG_VOUT) U5.50(D_VDD)
3V3: C1.2 C2.2 C3.2 C4.2 C5.2 C6.2 C7.2 C8.2 R9.1 U1.8(VCC) U5.1(IO_VDD) U5.10(IO_VDD) U5.22(IO_VDD) U5.26(RUN) U5.33(IO_VDD) U5.42(IO_VDD) U5.43(ADC_AVDD) U5.44(VREG_VIN) U5.48(USB_VDD) U5.49(IO_VDD) ; port 3V3
LEDData: U5.15(GPIO12) ; port LEDData
NetJ1_2: J1.2(-) R8.1
NetQt1_E: U5.38(GPIO26/ADC0) ; port TopScrollWheelOpto0
NetQt2_E: U5.40(GPIO28/ADC2) ; port TopScrollWheelOpto1
NetR5_1: U5.2(GPIO0) ; port MISO
NetR6_2: U5.46(USB_DM) ; port D-
NetR7_2: U5.47(USB_DP) ; port D+
NetR8_2: R8.2 R9.2 U1.1(~{CS}) U5.56(QSPI_SS_N)
NetR10_1: R10.1 U5.21(XOUT)
NetR10_2: R10.2 Y1.3
NetSW1_A: U5.18(GPIO15) ; port ButtonLeftClick
NetSW2_A: U5.35(GPIO23) ; port ButtonRightClick
NetSW3_A: U5.34(GPIO22) ; port ButtonRR
NetSW4_A: U5.17(GPIO14) ; port ButtonLL
NetSW5_A: U5.30(GPIO19) ; port ButtonForward
NetSW6_A: U5.36(GPIO24) ; port ButtonDPI
NetSW7_A: U5.28(GPIO17) ; port ButtonBack
NetSW8_A: U5.32(GPIO21) ; port ButtonScrollWheel
NetU1_2: U1.2(DO_(IO1)) U5.55(QSPI_SD1)
NetU1_3: U1.3(~{WP}_(IO2)) U5.54(QSPI_SD2)
NetU1_5: U1.5(DI_(IO0)) U5.53(QSPI_SD0)
NetU1_6: U1.6(CLK) U5.52(QSPI_SCLK)
NetU1_7: U1.7(~{HOLD}_or_~{RESET}_(IO3)) U5.51(QSPI_SD3)
NetU2_7: U5.16(GPIO13) ; port ~{RESET}
NetU2_9: U5.12(GPIO9) ; port MOTION
NetU2_10: U5.4(GPIO2) ; port SCLK
NetU2_11: U5.9(GPIO7) ; port MOSI
NetU2_13: U5.7(GPIO5) ; port ~{CS}
NetU5_20: U5.20(XIN) Y1.1

Not connected (* = marked no-connect by the designer): U5 24(SW_CLK) 25(SWD_IO)

### Notes on the sheet
- This header can be pinched with tweezers or otherwise shorted during startup to force the RP2040 into USB bootloader mode. To do this, short the header while the board is unpowered, and then plug a USB cable in. If successful, the computer the RP2040 is attached to should detect a USB mass storage device that you can then drag and drop a new firmware file onto. Very cool!
- (near U5) SPI0 RX
- (near U5) SPI0 CSn
- (near U5) SPI0 SCK
- (near U5) SPI0 TX
- This flash chip holds all of the program memory. The chosen component is a 16MB chip, but smaller ones from the same series could be substituted in to reduce cost (there's about a CAD$1 difference to be had).
  The nCS pin is tied high to ensure that the MCU normally boots off whatever is in flash. If you'd rather boot from USB, ground the nCS pin via the provided header and then reset the MCU using the RUN pin.
- The digital core voltage is 1.1V, and it is generated by an on-chip linear regulator that outputs at VREG_VOUT.
  The regulator requires a 1uF cap for stability at VREG_VIN and VREG_VOUT, and 0.1uF caps are added for each digital VDD pin for stability.
- Copyright Ploopy Corporation 2024
- Licensed under the CERN-OHL-S v2
- http://ohwr.org/cernohl
- Title:
- PCB:
- Version:
- Ploopy Corporation
- Mississauga ON L5C 0A3
- 137-1140 Burnhamthorpe Road W
- Date:
- Time:
- Sheet
- of
- Canada
- (in symbol RH100-12.000-16-3030) 12MHz

### Library data of the parts
C1 C3-C8 C22 C29 = Cap 0.1uF 25V: 0603, X5R or better; Supplier 1: Digi-Key; Supplier Part Number 1: 1276-6840-2-ND
C2 C9 = Cap 1uF 25V: 0805, X5R or better; Supplier 1: Digi-Key; Supplier Part Number 1: 1276-1066-2-ND; Supplier 2: Digi-Key; Supplier Part Number 2: 1276-1066-1-ND
J1 = HEADER2: 2-pin 0.100" header; Supplier 1: Mouser; Supplier Part Number 1: 855-M20-9990245; Supplier 2: Digi-Key; Supplier Part Number 2: 952-2261-ND
R8 R10 = Res 1k 1% 0805: Chip resistor, 1/8W 100PPM; Supplier 1: Digi-Key; Supplier Part Number 1: RMCF0805FT1K00TR-ND
R9 = Res 10k 1% 0805: Chip resistor; Supplier 1: Digi-Key; Supplier Part Number 1: RMCF0805FT10K0TR-ND
Y1 = RH100-12.000-16-3030: 12MHz Crystal 16pF 100 Ohms 4-SMD, No Lead (3.2mm x 2.5mm); Supplier 1: Digi-Key; Supplier 2: Mouser; Supplier Part Number 1: XC2686CT-ND; Supplier Part Number 2: 520-160-12-30B-AGMT
U1 = W25Q16JVSSIQ: Supplier 1: Digi-Key; Supplier Part Number 1: W25Q16JVSSIQ-ND
U5 = RP2040: Supplier 1: Newark; Supplier Part Number 1: 49AJ8740

## Sheet Buttons.SchDoc
size Letter; CompanyName: Ploopy Corporation; Organization: Ploopy Corporation; Address1: 137-1140 Burnhamthorpe Road W; Address2: Mississauga; Address3: Ontario; Address4: Canada L5C 0A3; DocumentNumber: 2; Revision: R1.003; SheetNumber: 2; SheetTotal: 9
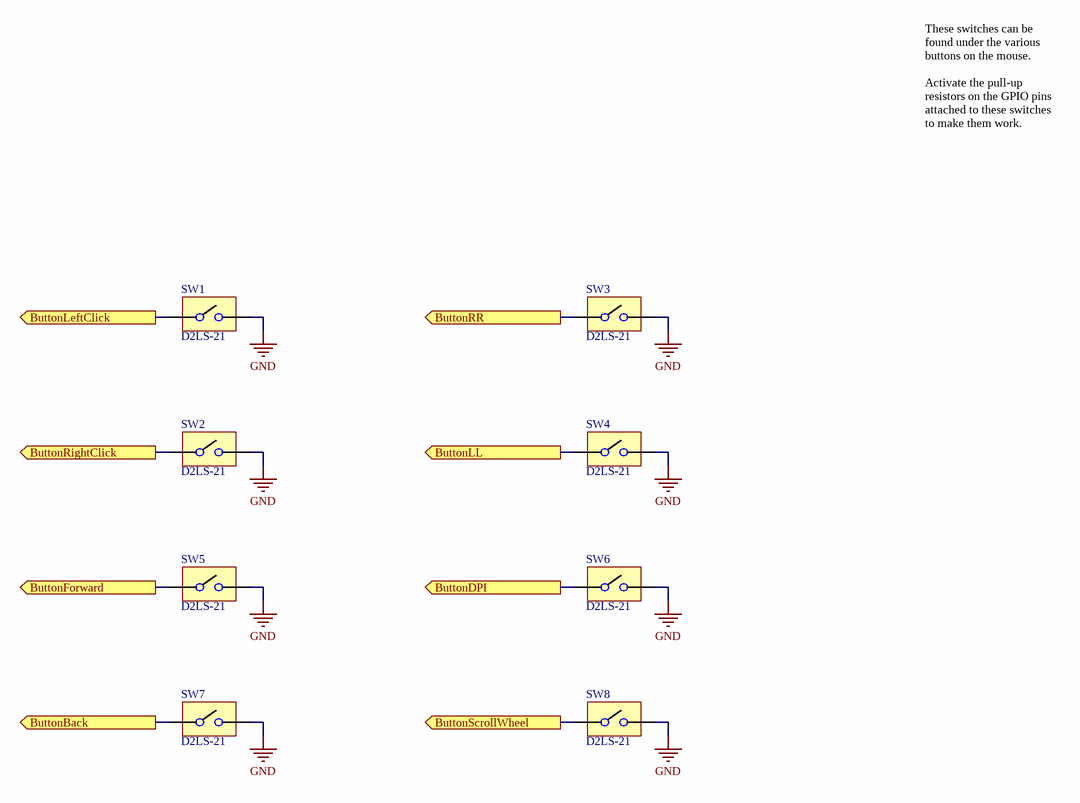
[diagram p7: Buttons.SchDoc]

### Parts
SW1  D2LS-21  [D2LS-21]
SW2  D2LS-21  [D2LS-21]
SW3  D2LS-21  [D2LS-21]
SW4  D2LS-21  [D2LS-21]
SW5  D2LS-21  [D2LS-21]
SW6  D2LS-21  [D2LS-21]
SW7  D2LS-21  [D2LS-21]
SW8  D2LS-21  [D2LS-21]

### Ports
ButtonBack (out), ButtonDPI (out), ButtonForward (out), ButtonLeftClick (out), ButtonLL (out), ButtonRightClick (out), ButtonRR (out), ButtonScrollWheel (out)

### Nets
GND: SW1.B SW2.B SW3.B SW4.B SW5.B SW6.B SW7.B SW8.B
NetSW1_A: SW1.A ; port ButtonLeftClick
NetSW2_A: SW2.A ; port ButtonRightClick
NetSW3_A: SW3.A ; port ButtonRR
NetSW4_A: SW4.A ; port ButtonLL
NetSW5_A: SW5.A ; port ButtonForward
NetSW6_A: SW6.A ; port ButtonDPI
NetSW7_A: SW7.A ; port ButtonBack
NetSW8_A: SW8.A ; port ButtonScrollWheel

### Notes on the sheet
- These switches can be found under the various buttons on the mouse.
  Activate the pull-up resistors on the GPIO pins attached to these switches to make them work.
- Copyright Ploopy Corporation 2024
- Licensed under the CERN-OHL-S v2
- http://ohwr.org/cernohl
- Title:
- PCB:
- Version:
- Ploopy Corporation
- Mississauga ON L5C 0A3
- 137-1140 Burnhamthorpe Road W
- Date:
- Time:
- Sheet
- of
- Canada

### Library data of the parts
SW1-SW8 = D2LS-21: Compact Surface-mounting Switch for long durability; Supplier 1: Digi-Key; Supplier 2: Mouser; Supplier Part Number 1: Z4378CT-ND; Supplier Part Number 2: 653-D2LS-21

## Sheet Mechanical.SchDoc
size Letter; CompanyName: Ploopy Corporation; Organization: Ploopy Corporation; Address1: 137-1140 Burnhamthorpe Road W; Address2: Mississauga; Address3: Ontario; Address4: Canada L5C 0A3; DocumentNumber: 6; Revision: R1.003; SheetNumber: 6; SheetTotal: 9
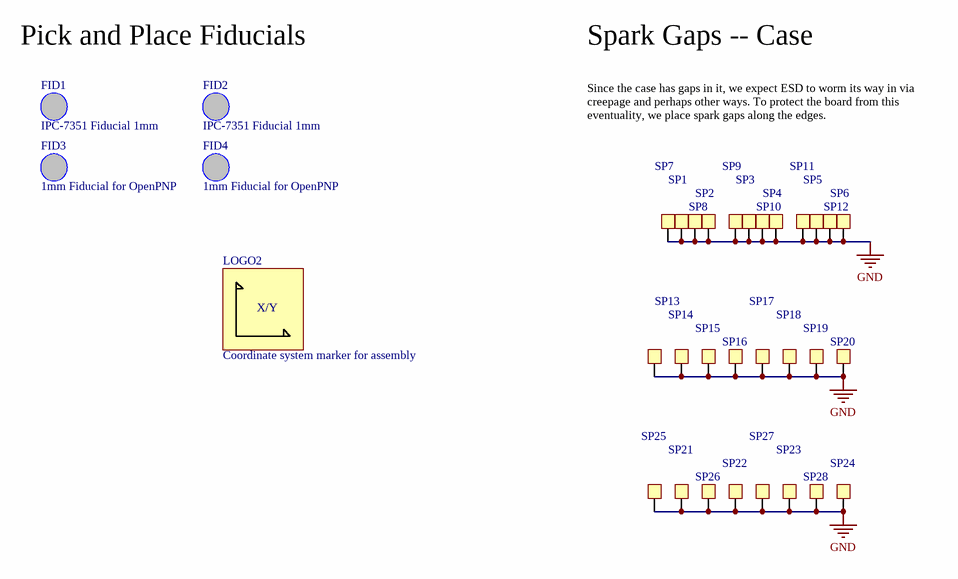
[diagram p8: Mechanical.SchDoc]

### Parts
FID1  IPC-7351 Fiducial 1mm  [FIDUCIAL_1.5]
FID2  IPC-7351 Fiducial 1mm  [FIDUCIAL_1.5]
FID3  1mm Fiducial for OpenPNP  [FIDUCIAL-NEW]
FID4  1mm Fiducial for OpenPNP  [FIDUCIAL-NEW]
LOGO2  Coordinate system marker for assembly  [Coordinate System]  (no BOM)
SP1  Spark Gap  [SparkGap]  (value not drawn)  (no BOM)
SP2  Spark Gap  [SparkGap]  (value not drawn)  (no BOM)
SP3  Spark Gap  [SparkGap]  (value not drawn)  (no BOM)
SP4  Spark Gap  [SparkGap]  (value not drawn)  (no BOM)
SP5  Spark Gap  [SparkGap]  (value not drawn)  (no BOM)
SP6  Spark Gap  [SparkGap]  (value not drawn)  (no BOM)
SP7  Spark Gap  [SparkGap]  (value not drawn)  (no BOM)
SP8  Spark Gap  [SparkGap]  (value not drawn)  (no BOM)
SP9  Spark Gap  [SparkGap]  (value not drawn)  (no BOM)
SP10  Spark Gap  [SparkGap]  (value not drawn)  (no BOM)
SP11  Spark Gap  [SparkGap]  (value not drawn)  (no BOM)
SP12  Spark Gap  [SparkGap]  (value not drawn)  (no BOM)
SP13  Spark Gap  [SparkGap]  (value not drawn)  (no BOM)
SP14  Spark Gap  [SparkGap]  (value not drawn)  (no BOM)
SP15  Spark Gap  [SparkGap]  (value not drawn)  (no BOM)
SP16  Spark Gap  [SparkGap]  (value not drawn)  (no BOM)
SP17  Spark Gap  [SparkGap]  (value not drawn)  (no BOM)
SP18  Spark Gap  [SparkGap]  (value not drawn)  (no BOM)
SP19  Spark Gap  [SparkGap]  (value not drawn)  (no BOM)
SP20  Spark Gap  [SparkGap]  (value not drawn)  (no BOM)
SP21  Spark Gap  [SparkGap]  (value not drawn)  (no BOM)
SP22  Spark Gap  [SparkGap]  (value not drawn)  (no BOM)
SP23  Spark Gap  [SparkGap]  (value not drawn)  (no BOM)
SP24  Spark Gap  [SparkGap]  (value not drawn)  (no BOM)
SP25  Spark Gap  [SparkGap]  (value not drawn)  (no BOM)
SP26  Spark Gap  [SparkGap]  (value not drawn)  (no BOM)
SP27  Spark Gap  [SparkGap]  (value not drawn)  (no BOM)
SP28  Spark Gap  [SparkGap]  (value not drawn)  (no BOM)

### Nets
GND: SP1.1 SP2.1 SP3.1 SP4.1 SP5.1 SP6.1 SP7.1 SP8.1 SP9.1 SP10.1 SP11.1 SP12.1 SP13.1 SP14.1 SP15.1 SP16.1 SP17.1 SP18.1 SP19.1 SP20.1 SP21.1 SP22.1 SP23.1 SP24.1 SP25.1 SP26.1 SP27.1 SP28.1

Not connected (* = marked no-connect by the designer): FID1 1; FID2 1; FID3 1; FID4 1

### Notes on the sheet
- Pick and Place Fiducials
- Spark Gaps -- Case
- Since the case has gaps in it, we expect ESD to worm its way in via creepage and perhaps other ways. To protect the board from this eventuality, we place spark gaps along the edges.
- Copyright Ploopy Corporation 2024
- Licensed under the CERN-OHL-S v2
- http://ohwr.org/cernohl
- Title:
- PCB:
- Version:
- Ploopy Corporation
- Mississauga ON L5C 0A3
- 137-1140 Burnhamthorpe Road W
- Date:
- Time:
- Sheet
- of
- Canada
- (in symbol CoordinateSystem) X/Y

### Library data of the parts
FID1 FID2 = FIDUCIAL_1.5: PNP-Nzl: 2; PNP-dx: 0; PNP-X: 4; PNP-A: 1; PNP-Thk: 1.02; PNP-TS: 70; PNP-Type: MARK1; PNP-dy: 0; PNP-Y: 4; PNP-Pt: 0; PNP-W: 0; PNP-Lv: 1; PNP-Level: 1; PNP-Voff: 0; PNP-FeedType: Fiducial; PNP-TapeWidth: 0; PNP-PlacePriority: 0; PNP-TapeIndex: 0; PNP-da: 0
FID3 FID4 = FIDUCIAL_NEW: This fiducial is designed to work with OpenPNP. It presents a circular pattern under the solder mask, to prevent glare issues from messing with the detection.; PNP-Nzl: 2; PNP-dx: 0; PNP-X: 4; PNP-A: 1; PNP-Thk: 1.02; PNP-TS: 70; PNP-Type: MARK1; PNP-dy: 0; PNP-Y: 4; PNP-Pt: 0; PNP-W: 0; PNP-Lv: 1; PNP-Level: 1; PNP-Voff: 0; PNP-FeedType: Fiducial; PNP-TapeWidth: 0; PNP-PlacePriority: 0; PNP-TapeIndex: 0; PNP-da: 0
LOGO2 = CoordinateSystem
SP1-SP28 = Spark Gap: Open square pad for spark gapping; PNP-Nzl: 2; PNP-dx: 0; PNP-X: 1; PNP-TS: 70; PNP-Type: CHI; PNP-FeedType: Tape; PNP-TapeWidth: 8; PNP-dy: 0; PNP-Y: 1; PNP-A: 0; PNP-Pt: 0; PNP-W: 0; PNP-Thk: 1; PNP-Lv: 1; PNP-Level: 1; PNP-Voff: 0; PNP-PlacePriority: 1; PNP-TapeIndex: 1; PNP-da: 0

## Nets that join several sheets
GND: Connectors (9 pins), LEDs (16 pins), Regulators (8 pins), ScrollWheel (D11.C D12.C R2.1 R4#1.1), MouseSensor (C10.1 C11.1 U2.8), MCU (30 pins), Buttons (8 pins), Mechanical (28 pins)
1V8: Regulators (C17.2 C18.2 U4.5), MouseSensor (R3#2.2 U2.4)
3V3: Regulators (C13.2 C14.2 U3.5), ScrollWheel (Qt1.C Qt2.C R1.2 R3#1.2), MouseSensor (R5.2 U2.5), MCU (20 pins)
LEDData: LEDs (R16.2 R17.2), MCU (U5.15)
NetQt1_E: ScrollWheel (Qt1.E R2.2), MCU (U5.38)
NetQt2_E: ScrollWheel (Qt2.E R4#1.2), MCU (U5.40)
NetR5_1: MouseSensor (R5.1 U2.12), MCU (U5.2)
NetR6_2: Connectors (R6.2), MCU (U5.46)
NetR7_2: Connectors (R7.2), MCU (U5.47)
NetSW1_A: MCU (U5.18), Buttons (SW1.A)
NetSW2_A: MCU (U5.35), Buttons (SW2.A)
NetSW3_A: MCU (U5.34), Buttons (SW3.A)
NetSW4_A: MCU (U5.17), Buttons (SW4.A)
NetSW5_A: MCU (U5.30), Buttons (SW5.A)
NetSW6_A: MCU (U5.36), Buttons (SW6.A)
NetSW7_A: MCU (U5.28), Buttons (SW7.A)
NetSW8_A: MCU (U5.32), Buttons (SW8.A)
NetU2_7: MouseSensor (U2.7), MCU (U5.16)
NetU2_9: MouseSensor (U2.9), MCU (U5.12)
NetU2_10: MouseSensor (U2.10), MCU (U5.4)
NetU2_11: MouseSensor (U2.11), MCU (U5.9)
NetU2_13: MouseSensor (U2.13), MCU (U5.7)
V_USB: Connectors (C19.2 FB1.2), LEDs (16 pins), Regulators (6 pins)